# EAGLE design receiver (EAGLE 6.1)
APVD: B.F 21-01-2013; DOC: PVR-SCH-002; PART_NO: IRR-01-A; PROJECT: USB IR Receiver; REV: A; TITLE: USB IR Receiver
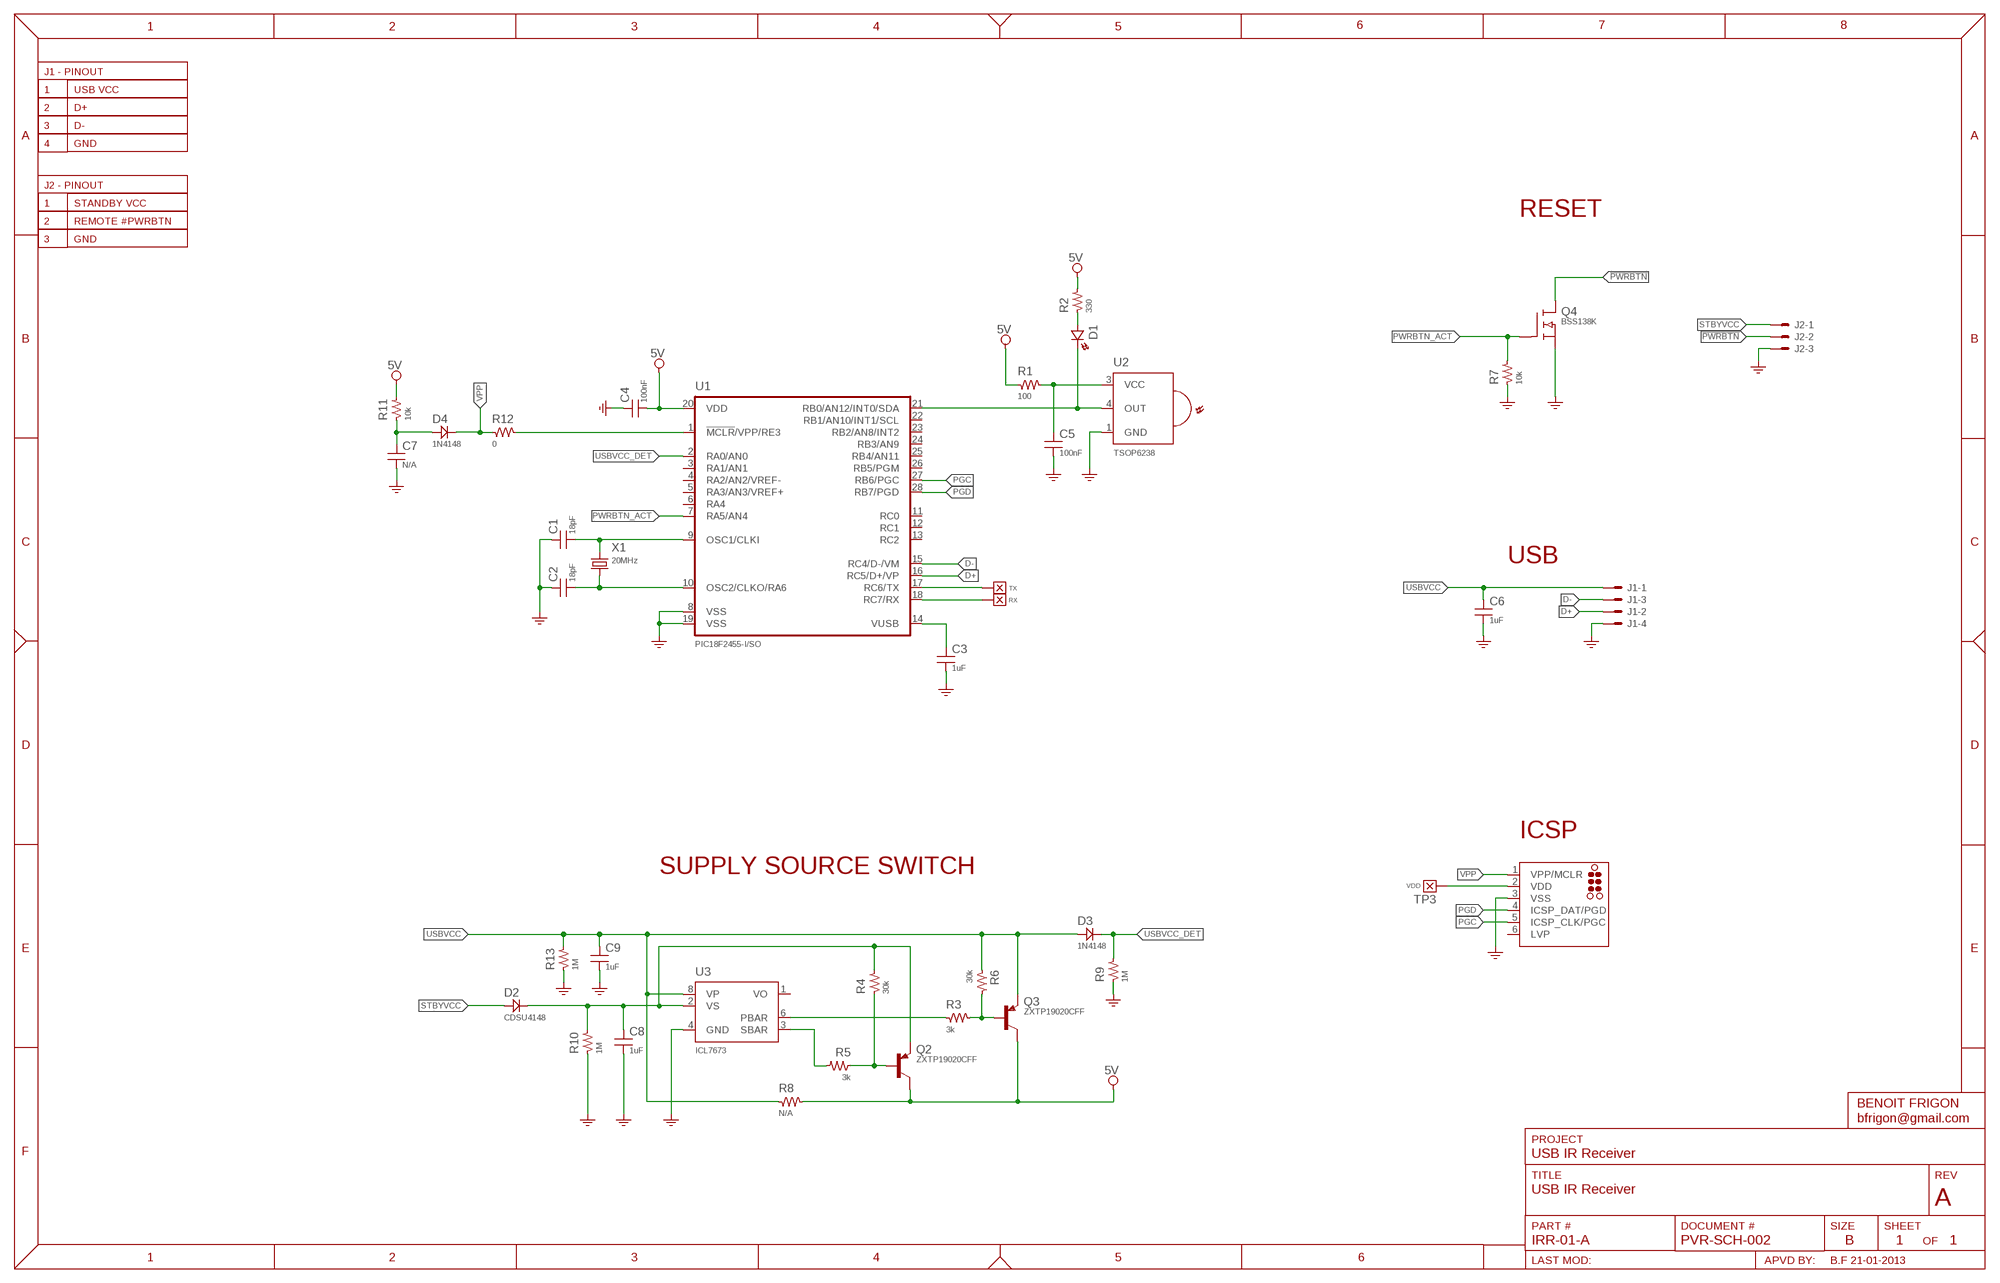
[diagram p0: schematic, sheet 1]

## Parts
C1  18pF  CAP-0603  [SMD_0603]
C2  18pF  CAP-0603  [SMD_0603]
C3  1uF  CAP-0603  [SMD_0603]
C4  100nF  CAP-0603  [SMD_0603]
C5  100nF  CAP-0603  [SMD_0603]
C6  1uF  CAP-0603  [SMD_0603]
C7  N/A  CAP-0603  [SMD_0603]
C8  1uF  CAP-0603  [SMD_0603]
C9  1uF  CAP-0603  [SMD_0603]
D1  {ATTR:COLOR}  LED-0805  [CHIPLED_0805]
D2  CDSU4148  DIODE-0603  [DIODE_0603]
D3  1N4148  DIODE-0603  [DIODE_0603]
D4  1N4148  DIODE-0603  [DIODE_0603]
J1  SNG-100-HEADER-04-FL-RA  [22-05-3041]
J2  SNG-100-HEADER-03-FL-RA  [22-05-3031]
J10  TC2030-MCP  [TC2030-MCP]
Q2  ZXTP19020CFF  [SOT23]
Q3  ZXTP19020CFF  [SOT23]
Q4  BSS138K  [SOT23]
R1  100  RES-0603  [SMD_0603]
R2  330  RES-0603  [SMD_0603]
R3  3k  RES-0603  [SMD_0603]
R4  30k  RES-0603  [SMD_0603]
R5  3k  RES-0603  [SMD_0603]
R6  30k  RES-0603  [SMD_0603]
R7  10k  RES-0603  [SMD_0603]
R8  N/A  RES-0805  [SMD_0805]
R9  1M  RES-0603  [SMD_0603]
R10  1M  RES-0603  [SMD_0603]
R11  10k  RES-0603  [SMD_0603]
R12  0  RES-0603  [SMD_0603]
R13  1M  RES-0603  [SMD_0603]
TP1  TX  TEST_POINT-050  [TP_050]
TP2  RX  TEST_POINT-050  [TP_050]
TP3  VDD  TEST_POINT-050  [TP_050]
U1  PIC18F2455-I/SO  [SOIC28]
U2  TSOP6238  [TSOP62XX]
U3  ICL7673  [SOIC8]
X1  20MHz  XTALSM49  [SM49]

## Nets
5V: C4.2 Q2.3(C) Q3.3(C) R1.1 R2.2 R8.2 R11.2 U1.20(VDD)
!PWRBTN: J2.2 Q4.3(D)
D+: J1.2 U1.16(RC5/D+/VP)
D-: J1.3 U1.15(RC4/D-/VM)
GND: C1.1 C2.1 C3.2 C4.1 C5.2 C6.2 C7.2 C8.2 C9.2 J1.4 J2.3 J10.3(VSS) Q4.2(S) R7.1 R9.1 R10.1 R13.1 U1.8(VSS) U1.19(VSS) U2.1(GND) U3.4(GND)
IR: D1.K U1.21(RB0/AN12/INT0/SDA) U2.4(OUT)
N$1: Q2.1(B) R4.1 R5.1
N$2: D1.A R2.1
N$5: C5.1 R1.2 U2.3(VCC)
N$7: Q3.1(B) R3.2 R6.2
N$8: R3.1 U3.6(PBAR)
N$9: R5.2 U3.3(SBAR)
N$10: C8.1 D2.K Q2.2(E) R4.2 R10.2 U3.2(VS)
N$12: J10.2(VDD) TP3.1
N$26: R12.2 U1.1(!MCLR!/VPP/RE3)
N$48: C7.1 D4.A R11.1
OSC1: C1.2 U1.9(OSC1/CLKI) X1.1
OSC2: C2.2 U1.10(OSC2/CLKO/RA6) X1.2
PGC: J10.5(ICSP_CLK/PGC) U1.27(RB6/PGC)
PGD: J10.4(ICSP_DAT/PGD) U1.28(RB7/PGD)
PWRBTN_ACT: Q4.1(G) R7.2 U1.7(RA5/AN4)
RX: TP2.1 U1.18(RC7/RX)
STBYVCC: D2.A J2.1
TX: TP1.1 U1.17(RC6/TX)
USBVCC: C6.1 C9.1 D3.A J1.1 Q3.2(E) R6.1 R8.1 R13.2 U3.8(VP)
USBVCC_DET: D3.K R9.2 U1.2(RA0/AN0)
VPP: D4.K J10.1(VPP/MCLR) R12.1
VUSB: C3.1 U1.14(VUSB)
Unconnected: J10.6(LVP) U1.3(RA1/AN1) U1.4(RA2/AN2/VREF-) U1.5(RA3/AN3/VREF+) U1.6(RA4) U1.11(RC0) U1.12(RC1) U1.13(RC2) U1.22(RB1/AN10/INT1/SCL) U1.23(RB2/AN8/INT2) U1.24(RB3/AN9) U1.25(RB4/AN11) U1.26(RB5/PGM)

## Notes on the sheet
- RESET
- USB
- ICSP
- SUPPLY SOURCE SWITCH

## Power pins joined to a net without a drawn wire
VO: U3.1(VO)

## Library data of the parts
C1-C9 = Passive:CAP: Capacitor; DESCRIPTION: {DESCRIPTION} - SMT 0603 - {value}; PACKAGE: SMT 0603
D1 = Optoelectronic:LED: Led; COLOR: Green; DESCRIPTION: {DESCRIPTION} Chip 0805 - {ATTR:COLOR}; PACKAGE: SMT 0805; SKU: -
D2-D4 = Passive:DIODE: Diode; DESCRIPTION: {DESCRIPTION} - SMT 0603 - {VALUE}; PACKAGE: SMT 0603; SKU: {VALUE}
J1 = Connectors:SNG-100-HEADER-04: 4 Pos - Single Row - 2.54mm header; DESCRIPTION: {DESCRIPTION} - R/A; MFG: Molex; SKU: 22-05-3041
J2 = Connectors:SNG-100-HEADER-03: 3 Pos - Single Row - 2.54mm header; DESCRIPTION: {DESCRIPTION} - R/A; MFG: Molex; SKU: 22-05-3031
J10 = Connectors:TC2030: TAG-CONNECT ISP Connector Manufacturer: Tag-Connect <www.tag-connect.com> Cable for easy In-Circuit PCB Programming. Designed for Microchip ICD2, suitable for many others. Two variants - one "with legs" (for hads-free fit on PCB) and another "without legs" for quick programming. PAD Description 1 MCLR/Vpp 2 Vdd 3 GND 4 PGD (ISPDAT) 5 PGC (ISPCLK) 6 nc (used for LVP) ©2009 ROFA.cz; MFG: Tag-Connect; NO_BOM: 1
Q2 Q3 = Transistor:ZXTP19020CFF: PNP medium power transistor - 20V; HFE: 110; MFG: Zetex; SKU: ZXTP19020CFF
Q4 = Transistor:BSS138: Mosfet N-Channel - 60V 0.23A - SOT-23
R1-R7 R9-R13 = Passive:RES: Resistor; DESCRIPTION: {DESCRIPTION} - SMT 0603 - {VALUE}; PACKAGE: SMT 0603
R8 = Passive:RES: Resistor; DESCRIPTION: {DESCRIPTION} - SMT 0805 - {VALUE}; PACKAGE: SMT 0805
TP1-TP3 = Misc:TEST_POINT; NO_BOM: 1
U1 = IC:PIC18F2*-?: Microcontroller; DESCRIPTION: {DESCRIPTION} - 24k PROG / 2048 RAM / 256 EEPROM; MFG: Microchip
U2 = Optoelectronic:TSOP6*: IR Receiver Module; DESCRIPTION: {DESCRIPTION} - 38kHz; MFG: Vishay Semiconductors
U3 = Power:ICL7673: Automatic Battery Back-Up Switch Features: Automatically Connects Output to the Greater of Either Input Supply Voltage If Main Power to External Equipment is Lost, Circuit Will Automatically Connect Battery Backup Reconnects Main Power When Restored Logic Indicator Signaling Status of Main Power Low Impedance Connection Switches Low Internal Power Consumption Wide Supply Range: . . . . . . . . . . . . . . . . . . . 2.5V to 15V Low Leakage Between Inputs External Transistors May Be Added if Very Large currents Need to Be Switched Pb-Free Plus Anneal Available (RoHS Compliant); MFG: Intersil; SKU: ICL7673CBA
X1 = Crystal:XTAL: Crystal; DESCRIPTION: {DESCRIPTION} - SM49 - {VALUE}; MFG: Cardinal Components; SKU: CSM1Z-A0B2C3-50-20.0D18

## Board
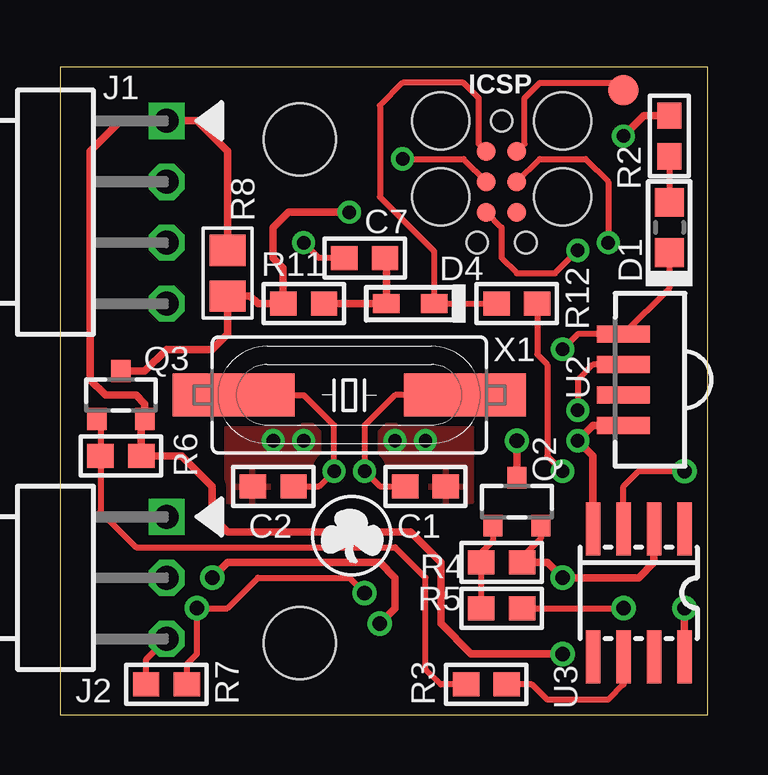
[diagram p1: board, top side]
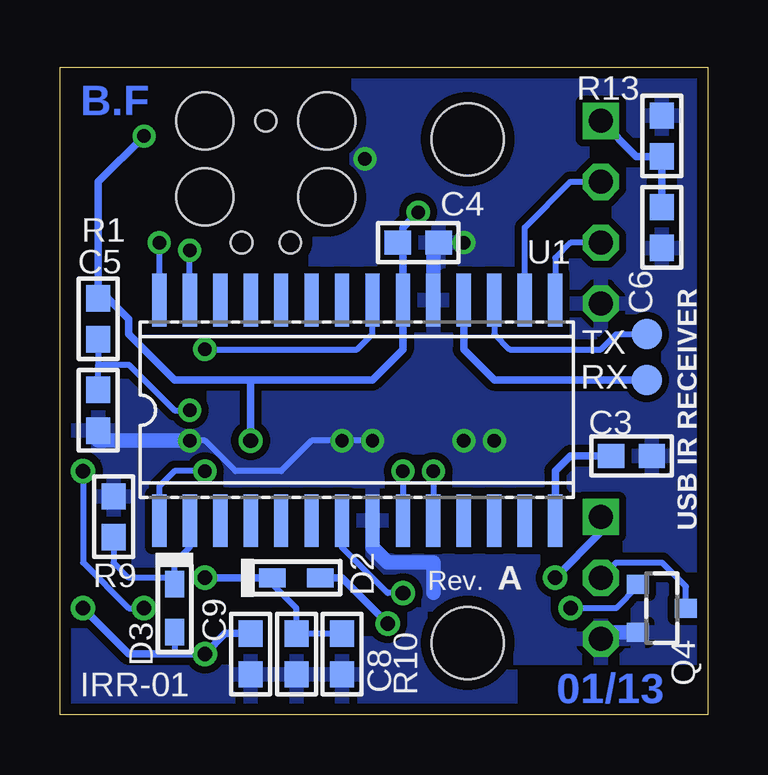
[diagram p2: board, bottom side, seen from below]

Size 27 x 27 mm. Coordinates in mm from the lower left corner, seen from the top.
Outline: 0,0 27,0 27,27 0,27 0,0
Copper layers (1*16): Top 0.035mm / dielectric 1.5mm / Bottom 0.035mm
Design rules: minimum track width 9mil, minimum drill 22mil, track to track 8mil, track to pad 8mil, pad to pad 8mil, via to via 8mil, smd to smd 8mil, copper to edge 18mil, drill to drill 8mil, minimum pad ring 10mil, minimum via ring 8mil, stop-mask expansion 4mil, vias tented up to drill 24mil, thermal gap 10mil
Holes 3 mm at 10,3 10,24
tKeepout: area 6.2,-0.8 to 13.8,6.8; area 6.2,20.1 to 13.8,27.8
bKeepout: area 6.2,20.1 to 13.8,27.8; area 6.2,-0.8 to 13.8,6.8
bRestrict: area 0.3,0 to 7.6,1.8

### Footprints (pad centres in the part's own frame; a part is rotated, then mirrored left to right if it is on the bottom)
SMD_0603 = smd 1.1 x 1: 1 -0.85,0; 2 0.85,0
CHIPLED_0805 = smd 1.2 x 1.2: A 0,-1.05; K 0,1.05
DIODE_0603 = smd 1.1 x 0.8: A -1,0; K 1,0
22-05-3041 = drill 1 square: 1 3.81,0 | drill 1 octagon: 2 1.27,0; 3 -1.27,0; 4 -3.81,0
22-05-3031 = drill 1 square: 1 2.54,0 | drill 1 octagon: 2 0,0; 3 -2.54,0
TC2030-MCP = smd 0.787 x 0.787: 1 1.27,-0.635; 2 1.27,0.635; 3 2.54,-0.635; 4 2.54,0.635; 5 3.81,-0.635; 6 3.81,0.635 | hole 0.889: 0,0; 5.08,-1.016; 5.08,1.016 | hole 2.375: 0,2.54; 0,-2.54; 3.175,-2.54; 3.175,2.54
SOT23 = smd 0.8 x 0.9: 1 -1,-1; 2 1,-1; 3 0,1
SMD_0805 = smd 1.3 x 1.5: 1 -0.95,0; 2 0.95,0
TP_050 = smd 1.27 x 1.27: 1 0,0
SOIC28 = smd 0.6 x 2.2: 1 -8.255,-4.6; 2 -6.985,-4.6; 3 -5.715,-4.6; 4 -4.445,-4.6; 5 -3.175,-4.6; 6 -1.905,-4.6; 7 -0.635,-4.6; 8 0.635,-4.6; 9 1.905,-4.6; 10 3.175,-4.6; 11 4.445,-4.6; 12 5.715,-4.6; 13 6.985,-4.6; 14 8.255,-4.6; 15 8.255,4.6; 16 6.985,4.6; 17 5.715,4.6; 18 4.445,4.6; 19 3.175,4.6; 20 1.905,4.6; 21 0.635,4.6; 22 -0.635,4.6; 23 -1.905,4.6; 24 -3.175,4.6; 25 -4.445,4.6; 26 -5.715,4.6; 27 -6.985,4.6; 28 -8.255,4.6
TSOP62XX = smd 0.7 x 2.2: 1 -1.905,0.635; 2 -0.635,0.635; 3 0.635,0.635; 4 1.905,0.635
SOIC8 = smd 0.6 x 2.2: 1 -1.905,-2.667; 2 -0.635,-2.667; 3 0.635,-2.667; 4 1.905,-2.667; 5 1.905,2.667; 6 0.635,2.667; 7 -0.635,2.667; 8 -1.905,2.667
SM49 = smd 5.08 x 1.778: 1 -4.826,0; 2 4.826,0

### Placement (x,y rotation side)
C1  15.24,9.53 180 top
C2  8.89,9.53 0 top
C3  3.17,10.79 0 bottom
C4  12.06,19.68 180 bottom
C5  25.4,12.7 270 bottom
C6  1.91,20.32 270 bottom
C7  12.7,19.05 180 top
C8  17.14,2.54 270 bottom
C9  19.05,2.54 270 bottom
D1  25.4,20.32 180 top
D2  17.14,5.71 180 bottom
D3  22.23,4.45 90 bottom
D4  14.61,17.14 0 top
J1  4.45,20.95 90 top
J2  4.45,5.71 90 top
J10  18.41,24.77 270 top
Q2  19.05,8.89 0 top
Q3  2.54,13.34 0 top
Q4  1.91,4.45 270 bottom
R1  25.4,16.51 270 bottom
R2  25.4,24.13 90 top
R3  17.78,1.27 180 top
R4  18.41,6.35 0 top
R5  18.41,4.45 0 top
R6  2.54,10.79 180 top
R7  4.45,1.27 0 top
R8  6.99,18.41 270 top
R9  24.77,8.26 270 bottom
R10  15.24,2.54 90 bottom
R11  10.16,17.14 180 top
R12  19.05,17.14 0 top
R13  1.91,24.13 270 bottom
TP1  2.54,15.88 0 bottom
TP2  2.54,13.97 0 bottom
TP3  23.5,26.04 0 top
U1  14.61,12.7 0 bottom
U2  24.13,13.97 90 top
U3  24.13,5.08 180 top
U$1  [INFO_DATE]  3.81,1.27 180 bottom
U$2  [ARROW]  6.35,24.77 270 top
U$3  [ARROW]  6.35,8.26 270 top
U$4  [LOGO2]  12.19,7.49 0 top
U$5  [INFO_AUTHOR]  24.38,25.78 180 bottom
X1  12.06,13.34 180 top

### Tracks (layer width: path | path; a pad name or v marks a point on that pad's centre or on a via)
5V  (via drill 0.56, 0.61)
  Top 0.305: v12.06,20.95 9.53,20.95 8.89,20.32 8.89,19.05 9.31,18.63 R11.2 8.26,17.14 7.93,17.46 R8.2 6.99,15.88 6.35,15.24 4.45,15.24 3.54,14.34 Q3.3 | R2.2 24.34,24.98 v23.5,24.13 | v19.05,11.43 Q2.3
  Bottom 0.305: 19.05,13.97 13.97,13.97 12.7,15.24 U1.20 12.7,19.68 | 19.05,13.97 22.23,13.97 24.13,15.88 24.13,16.51 24.98,17.36 R1.1 25.4,22.23 v23.5,24.13 | 12.7,19.68 12.7,20.32 v12.06,20.95 | 19.05,13.97 v19.05,11.43 | C4.2 12.7,19.68
!PWRBTN
  Bottom 0.254: J2.2 3.81,6.35 1.91,6.35 0.91,5.35 Q4.3
D+
  Bottom 0.254: U1.16 7.62,20.32 5.71,22.23 J1.2
D-
  Bottom 0.254: J1.3 5.71,19.68 6.35,19.05 U1.15
GND  (via drill 0.56)
  Top 0.254: J10.3 16.83,23.18 v14.29,23.18 | C7.2 10.79,19.05 v10.16,19.68 | R7.1 3.6,2.33 J2.3
  Top 0.305: U2.1 22.23,12.06 v21.59,11.43 22.23,10.79 U3.4
  Bottom 0.254: v13.97,11.43 16.51,11.43 17.78,10.16 19.68,10.16 20.95,11.43 v21.59,11.43
  Bottom 0.61: U1.19 11.43,19.47 C4.1 | Q4.2 4.17,3.44 J2.3 | C5.2 25.4,11.43 v21.59,11.43 | U1.8 13.97,6.99 13.34,6.35 11.43,6.35 11.43,5.08
  other vias: 10.16,11.43 8.89,11.43 15.24,11.43
  pour Bottom (isolate 0.305): 0,0 0,27.3 27.3,27.3 27.3,0
  pour Top (isolate 0.406): 6.99,8.89 6.99,12.06 10.79,12.06 10.79,8.89
  pour Top (isolate 0.406): 13.34,8.89 13.34,12.06 17.14,12.06 17.14,8.89
IR  (via drill 0.56)
  Top 0.254: v20.95,15.24 21.59,15.88 U2.4 25.4,17.78 D1.K
  Bottom 0.254: v20.95,15.24 14.61,15.24 13.97,15.88 U1.21
N$1
  Top 0.254: R5.1 R4.1 17.57,6.77 18.05,7.25 Q2.1
N$2
  Top 0.254: R2.1 D1.A
N$5  (via drill 0.56)
  Top 0.254: U2.3 22.23,14.61 21.59,13.97 v21.59,12.7
  Bottom 0.254: R1.2 25.4,14.61 | C5.1 25.4,14.61 | 25.4,14.61 24.13,14.61 22.23,12.7 v21.59,12.7
N$7
  Top 0.254: Q3.1 1.69,12.34 R6.2 1.69,8.47 3.17,6.99 13.97,6.99 15.24,5.71 15.24,1.91 15.88,1.27 R3.2
N$8
  Top 0.254: U3.6 23.5,1.27 22.86,0.64 20.32,0.64 19.68,1.27 R3.1
N$9  (via drill 0.61)
  Top 0.254: U3.3 23.5,9.53 24.13,10.16 v26.04,10.16 | R5.2 v23.5,4.45
  Bottom 0.254: v26.04,10.16 26.04,6.35 24.13,4.45 v23.5,4.45
N$10  (via drill 0.61)
  Top 0.254: Q2.2 20.05,7.35 19.27,6.57 R4.2
  Top 0.305: U3.2 24.77,6.35 24.13,5.71 v20.95,5.71 20.32,6.35 R4.2
  Bottom 0.254: R10.2 C8.1 17.14,4.45 18.14,5.45 D2.K
  Bottom 0.305: v20.95,5.71 D2.K
N$12
  Top 0.254: J10.2 19.37,23.81 19.37,25.72 20,26.35 23.18,26.35 TP3.1 | TP3.1
N$26  (via drill 0.56)
  Top 0.254: R12.2 19.9,15.03 20.32,14.61 20.32,10.79 v20.95,10.16
  Bottom 0.254: v20.95,10.16 22.23,10.16 22.86,9.53 U1.1
N$48
  Top 0.305: R11.1 D4.A 13.61,19.05
  Top 0.406: 13.61,19.05 C7.1
OSC1  (via drill 0.56)
  Top 0.254: C1.2 13.34,9.53 v12.7,10.16 12.7,12.06 13.97,13.34 X1.1
  Bottom 0.254: v12.7,10.16 U1.9
OSC2  (via drill 0.56)
  Top 0.254: C2.2 10.79,9.53 v11.43,10.16 11.43,12.06 10.16,13.34 X1.2
  Bottom 0.254: v11.43,10.16 U1.10
PGC  (via drill 0.56)
  Top 0.254: J10.5 18.41,20.32 18.41,19.05 19.05,18.41 20.64,18.41 v21.59,19.37
  Bottom 0.254: U1.27 v21.59,19.37
PGD  (via drill 0.56)
  Top 0.254: J10.4 20,23.18 21.91,23.18 22.86,22.23 v22.86,19.68
  Bottom 0.254: v22.86,19.68 U1.28 22.86,17.14
PWRBTN_ACT  (via drill 0.61)
  Top 0.254: R7.2 5.29,2.12 5.71,2.54 v5.71,4.45 6.99,4.45 8.26,5.71 12.06,5.71 v12.7,5.08
  Bottom 0.254: Q4.1 2.9,5.35 3.81,4.45 v5.71,4.45 | v12.7,5.08 13.34,5.08 15.24,6.99 U1.7
RX
  Bottom 0.305: U1.18 10.16,15.24 8.89,13.97 TP2.1
STBYVCC  (via drill 0.61)
  Top 0.305: v6.35,5.71 6.99,6.35 13.34,6.35 13.97,5.71 13.97,4.45 v13.34,3.81
  Bottom 0.305: J2.1 4.45,7.62 v6.35,5.71 | D2.A 15.24,5.71 v13.34,3.81
TX
  Bottom 0.254: U1.17 8.89,15.88 8.26,15.24 4.45,15.24 3.81,15.88 TP1.1
USBVCC  (via drill 0.61)
  Top 0.305: U3.8 v26.04,4.45 | v20.95,2.54 17.14,2.54 15.88,3.81 15.88,6.35 14.61,7.62 6.99,7.62 6.35,8.26 6.35,9.53 5.08,10.79 3.81,10.79 3.39,11.21 R6.1 3.39,12.34 Q3.2 3.54,12.97 3.17,13.34 1.91,13.34 1.27,13.97 1.27,23.5 2.54,24.77 J1.1 5.71,24.77 6.99,23.5 R8.1
  Bottom 0.254: D3.A 22.23,2.54
  Bottom 0.305: v26.04,4.45 24.13,2.54 22.23,2.54 v20.95,2.54 20.11,3.39 C9.1 | J1.1 2.96,23.28 R13.2 C6.1
USBVCC_DET
  Bottom 0.254: U1.2 21.59,6.99 22.23,6.35 D3.K 22.23,5.71 24.13,5.71 24.77,6.35 R9.2
VPP
  Top 0.254: J10.1 17.46,23.81 17.46,25.72 16.83,26.35 14.29,26.35 13.34,25.4 13.34,21.59 15.61,19.32 D4.K R12.1
VUSB
  Bottom 0.305: C3.1 5.71,10.79 6.35,10.16 U1.14

### Text on the board
tPlace: ICSP
bPlace: USB IR RECEIVER | TX | RX | Rev.
_tsilk: J1 | ICSP | R2 | R8 | C7 | D1 | R11 | D4 | X1 | R12 | U2 | Q3 | R6 | Q2 | C1 | C2 | R4 | R5 | J2 | R3 | R7 | U3
_bsilk: R13 | C4 | U1 | R1 | C6 | C5 | USB IR RECEIVER | TX | RX | C3 | D2 | R9 | A | Rev. | Q4 | C8 | C9 | D3 | R10 | IRR-01